# EAGLE schematic eagleproject (EAGLE 9.5.2)
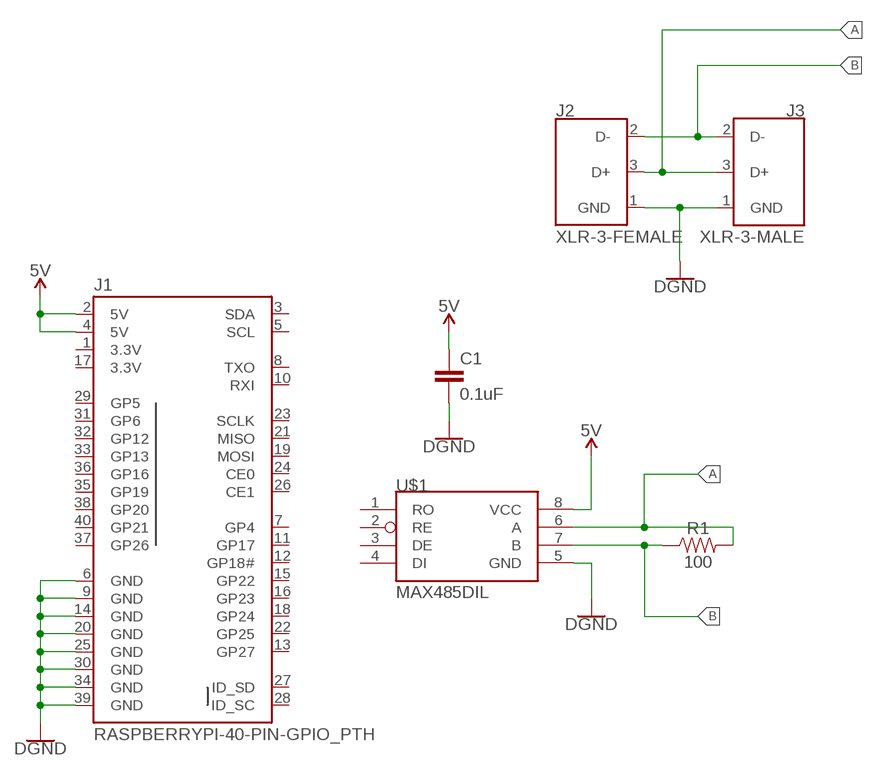
[diagram p0: schematic, sheet 1]

## Parts
C1  0.1uF  0.1UF-0603-25V-(+80/-20%)  [0603]
J1  RASPBERRYPI-40-PIN-GPIO_PTH  [2X20_SHROUDED]
J2  XLR-3-FEMALE  [XLR-3_FEMALE]
J3  XLR-3-MALE  [XLR-3_MALE]
R1  100  100OHM-0603-1/4W-5%  [0603]
U$1  MAX485DIL  [DIL08]

## Nets
5V: C1.1 J1.2(5V) J1.4(5V) U$1.8(VCC)
A: J2.3(D+) J3.3(D+) R1.2 U$1.6(A)
B: J2.2(D-) J3.2(D-) R1.1 U$1.7(B)
GND: C1.2 J1.6(GND) J1.9(GND) J1.14(GND) J1.20(GND) J1.25(GND) J1.30(GND) J1.34(GND) J1.39(GND) J2.1(GND) J3.1(GND) U$1.5(GND) ; supply symbol labelled DGND
Unconnected: J1.3(SDA) J1.5(SCL) J1.7(GP4) J1.8(TXO) J1.10(RXI) J1.11(GP17) J1.12(GP18#) J1.13(GP27) J1.15(GP22) J1.16(GP23) J1.18(GP24) J1.19(MOSI) J1.21(MISO) J1.22(GP25) J1.23(SCLK) J1.24(CE0) J1.26(CE1) J1.27(ID_SD) J1.28(ID_SC) J1.29(GP5) J1.31(GP6) J1.32(GP12) J1.33(GP13) J1.35(GP19) J1.36(GP16) J1.37(GP26) J1.38(GP20) J1.40(GP21) U$1.1(RO) U$1.2(RE) U$1.3(DE) U$1.4(DI)

## Power pins joined to a net without a drawn wire
3.3V: J1.1(3.3V) J1.17(3.3V)

## Library data of the parts
C1 = SparkFun-Capacitors:0.1UF: 0.1µF ceramic capacitors A capacitor is a passive two-terminal electrical component used to store electrical energy temporarily in an electric field.; PROD_ID: CAP-00810
J1 = SparkFun-Connectors:RASPBERRYPI-40-PIN-GPIO: Raspberry Pi GPIO Header 2x20 pin connector, as found on B, B+, A+ models. Both shrouded PTH and SMT versions available. SparkFun Products: GPIO Shrouded Header <https://www.sparkfun.com/products/13054>- PTH SparkFun Pi Wedge (Preassembled) <https://www.sparkfun.com/products/13717>; PROD_ID: CONN-12263; SF_ID: PRT-13054
J2 = SparkFun-Connectors:XLR-3: Neutrik XLR-3 Jack - XLR-3 Jack for DMX Symbol for a horizontal, 3-pin DMX connector; PROD_ID: CONN-14142
J3 = SparkFun-Connectors:XLR-3: Neutrik XLR-3 Jack - XLR-3 Jack for DMX Symbol for a horizontal, 3-pin DMX connector; PROD_ID: CONN-14141
R1 = SparkFun-Resistors:100OHM: 100Ω resistor A resistor is a passive two-terminal electrical component that implements electrical resistance as a circuit element. Resistors act to reduce current flow, and, at the same time, act to lower voltage levels within circuits. - Wikipedia; PROD_ID: RES-12438
U$1 = SparkFun-Retired:MAX485: RS-485 transceiver